# Altium schematic sheet 32电路图.SchDoc
size A3
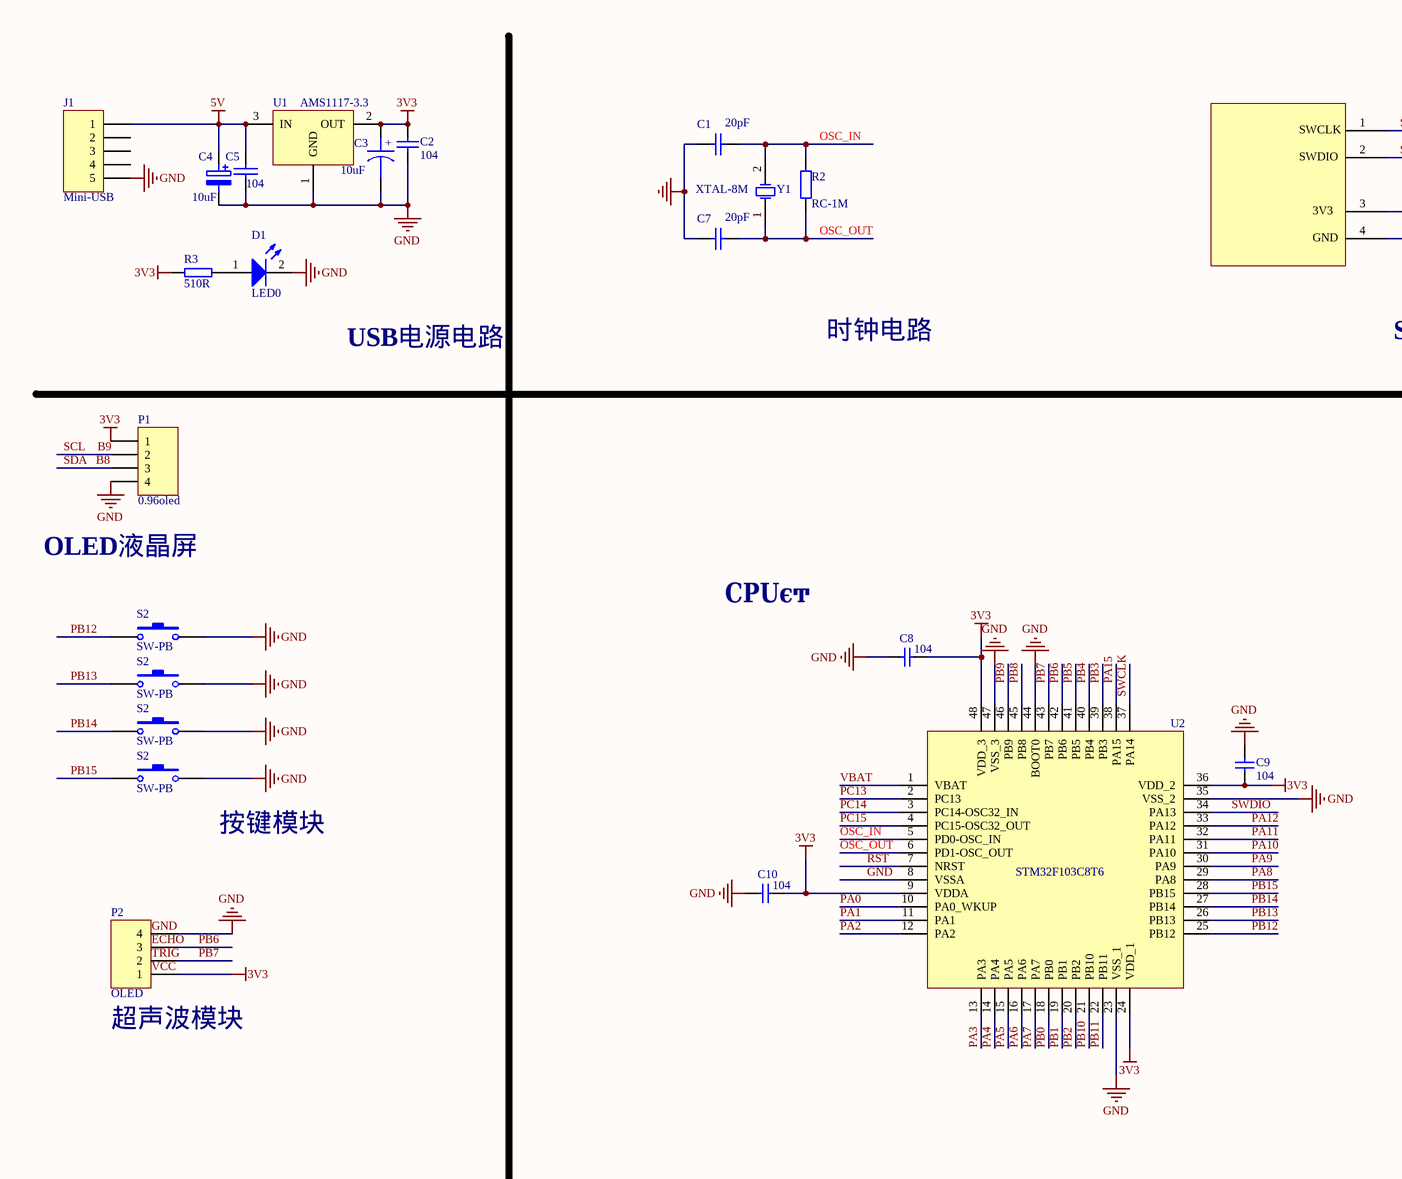
[diagram p0: 32电路图.SchDoc, left]
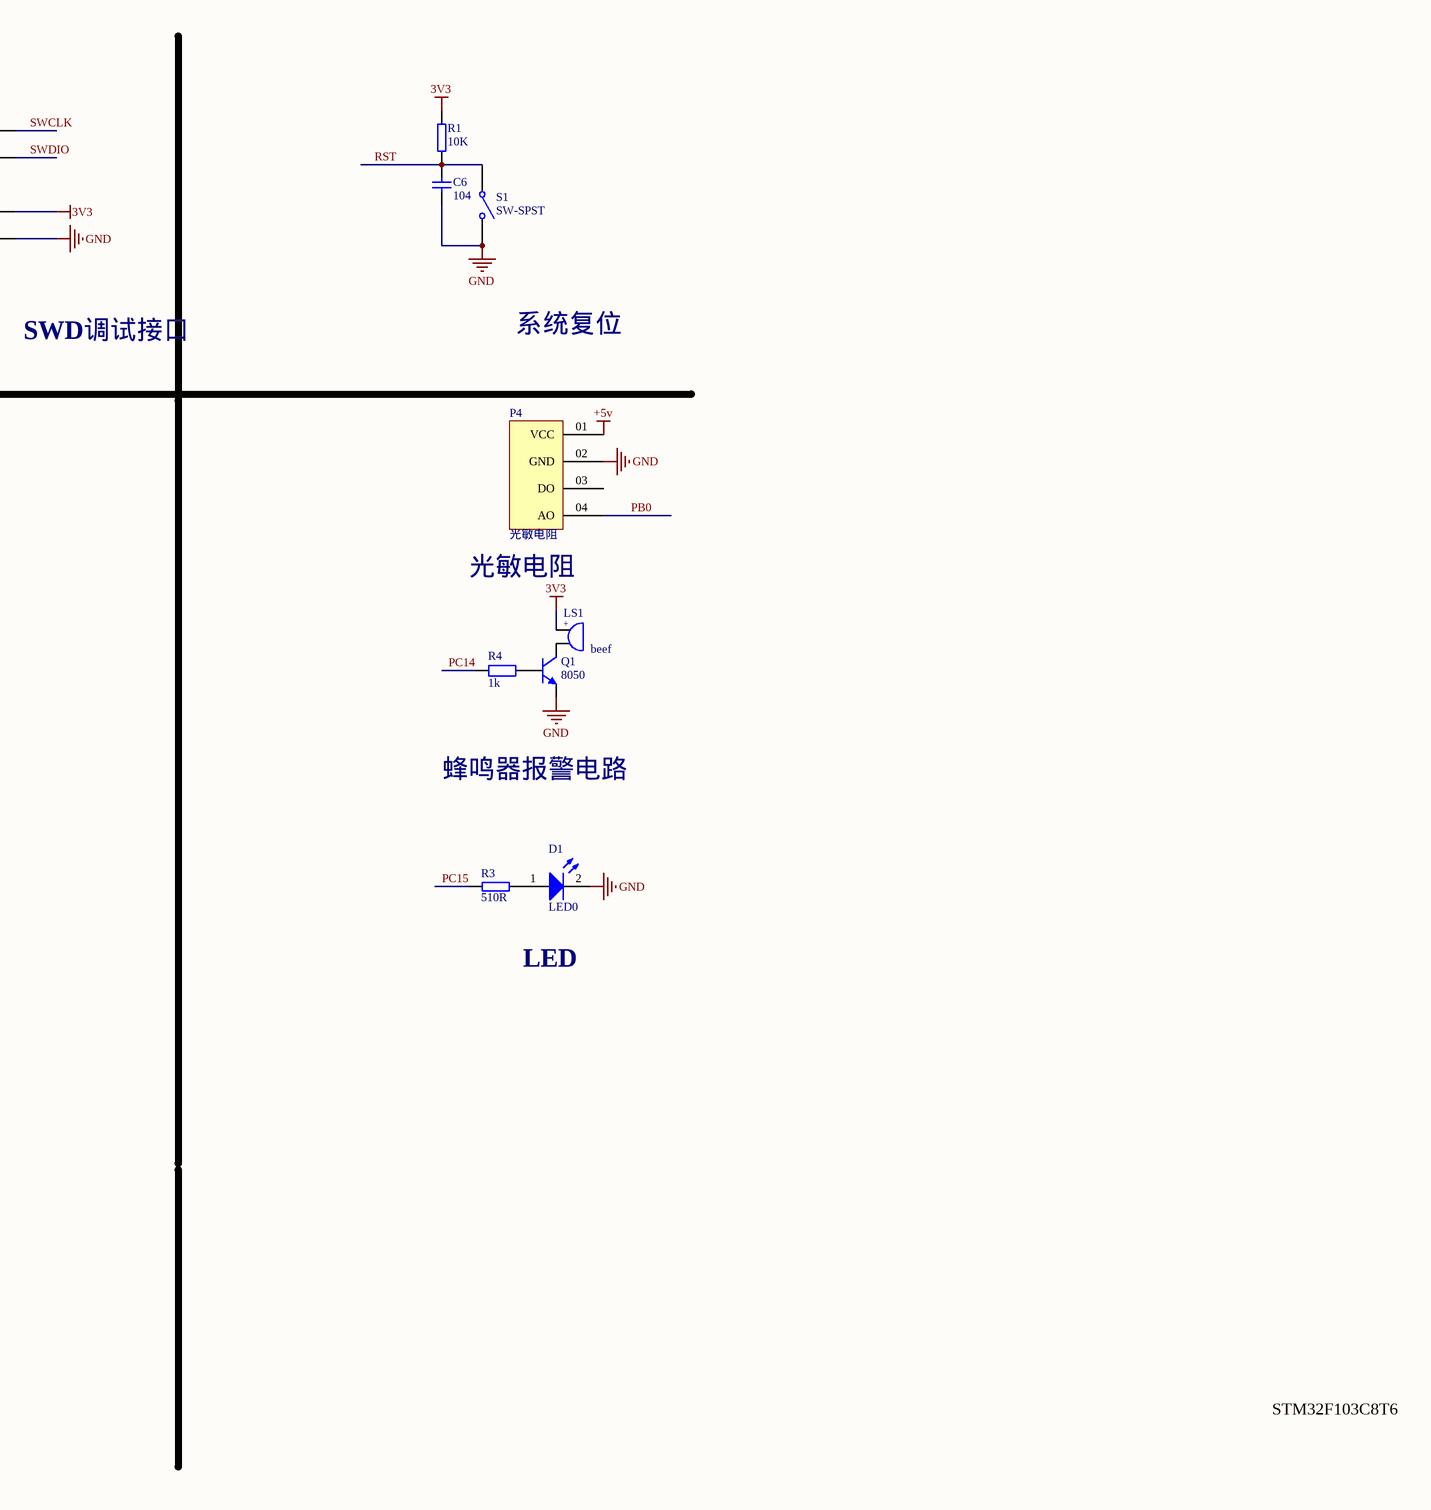
[diagram p1: 32电路图.SchDoc, right]

## Parts
(Parts that share a designator on the sheet are numbered #1, #2 ... from top to bottom, then left to right.)
C1  value 20pF  [0805C]  (hidden comment: S0805-20P)
C2  104  [RC0603]
C3  10uF  [RC0805]
C4  10uF  [RC0805]
C5  104  [RC0603]
C6  104  [RC0603]
C7  value 20pF  [0805C]  (hidden comment: S0805-20P)
C8  104  [RC0603]
C9  104  [RC0603]
C10  104  [RC0603]
D1#1  LED0  [LED0805]
D1#2  LED0  [LED0805]
J1  Mini-USB  [mini_USB]
LS1  beef  [BEEP 5x9x5.5]
P1  0.96oled  [HDR1X4]
P2  OLED  [HDR1X4]
P4  光敏电阻
Q1  8050  [TO92A]
R1  10K  [RC0603]
R2  RC-1M  [0805]
R3#1  510R  [RC0603]
R3#2  510R  [RC0603]
R4  1k  [R 0805_L]
S1  SW-SPST  [SMT-KEY]
S2#1  SW-PB  [SPST-2]
S2#2  SW-PB  [SPST-2]
S2#3  SW-PB  [SPST-2]
S2#4  SW-PB  [SPST-2]
U1  AMS1117-3.3  [SOT223]
U2  STM32F103C8T6  [LQFP48_STM32]
Y1  XTAL-8M  [XTAL-SMD1]

## Nets
3V3: C2.1 C3.1 C8.1 C9.1 C10.1 LS1.1 P1.1 P2.1 R1.2 R3#1.2 U1.2(OUT) U2.9(VDDA) U2.24(VDD_1) U2.36(VDD_2) U2.48(VDD_3)
5V: C4.1 C5.1 J1.1 U1.3(IN)
+5v: P4.01(VCC)
GND: C1.1 C2.2 C3.2 C4.2 C5.2 C6.2 C7.1 C8.2 C9.2 C10.2 D1#1.2(K) D1#2.2(K) J1.5 P1.4 P2.4 P4.02(GND) Q1.1(E) S1.2(NO) S2#1.2 S2#2.2 S2#3.2 S2#4.2 U1.1(GND) U2.8(VSSA) U2.23(VSS_1) U2.35(VSS_2) U2.44(BOOT0) U2.47(VSS_3)
OSC_IN: C1.2 R2.2 U2.5(PD0-OSC_IN) Y1.2(OSC2)
OSC_OUT: C7.2 R2.1 U2.6(PD1-OSC_OUT) Y1.1(OSC1)
PA0: U2.10(PA0_WKUP)
PA1: U2.11(PA1)
PA2: U2.12(PA2)
PA3: U2.13(PA3)
PA4: U2.14(PA4)
PA5: U2.15(PA5)
PA6: U2.16(PA6)
PA7: U2.17(PA7)
PA8: U2.29(PA8)
PA9: U2.30(PA9)
PA10: U2.31(PA10)
PA11: U2.32(PA11)
PA12: U2.33(PA12)
PA15: U2.38(PA15)
PB0: P4.04(AO) U2.18(PB0)
PB1: U2.19(PB1)
PB2: U2.20(PB2)
PB3: U2.39(PB3)
PB4: U2.40(PB4)
PB5: U2.41(PB5)
PB6: P2.3 U2.42(PB6)
PB7: P2.2 U2.43(PB7)
PB8: U2.45(PB8)
PB9: U2.46(PB9)
PB10: U2.21(PB10)
PB11: U2.22(PB11)
PB12: S2#1.1 U2.25(PB12)
PB13: S2#2.1 U2.26(PB13)
PB14: S2#3.1 U2.27(PB14)
PB15: S2#4.1 U2.28(PB15)
PC13: U2.2(PC13)
PC14: R4.1 U2.3(PC14-OSC32_IN)
PC15: R3#2.2 U2.4(PC15-OSC32_OUT)
RST: C6.1 R1.1 S1.1(COMMON) U2.7(NRST)
SCL    B9: P1.2
SDA   B8: P1.3
SWCLK: U2.37(PA14)
SWDIO: U2.34(PA13)
VBAT: U2.1(VBAT)
NetD1#1_1: D1#1.1(A) R3#1.1
NetD1#2_1: D1#2.1(A) R3#2.1
NetLS1_2: LS1.2 Q1.3(C)
NetQ1_2: Q1.2(B) R4.2

Not connected (* = marked no-connect by the designer): J1 2 3 4; P4 03(DO)

## Notes on the sheet
- SWCLK
- SWDIO
- 1
- 2
- 3V3
- GND
- 3
- 4
- USB电源电路
- 时钟电路
- SWD调试接口
- 系统复位
- OLED液晶屏
- 光敏电阻
- CPUϵͳ
- 蜂鸣器报警电路
- (near S2#4) 按键模块
- LED
- (near P2) 超声波模块
- STM32F103C8T6
- Labels drawn without touching a wire or pin: ECHO, GND, TRIG, VCC
- (in symbol BEEP) +
- (in symbol CAPACITOR POL) +

## Library data of the parts
C1 C2 C7 = Cap: Capacitor; Published: 8-Jun-2000; LatestRevisionDate: 17-Jul-2002; LatestRevisionNote: Re-released for DXP Platform.; Publisher: Altium Limited
  C2: PackageReference: RAD-0.3
C3 = CAPACITOR POL: Capacitor
C4 = ELECTRO2
C5 = CAP: Capacitor
C6 = CAP1: Capacitor; Tolerate: 50V; Value: 100nF; TOL: 10%; ERP: 0103020075; PCB_Layout: Top Layer SMC; Revision: 2012-3-28; Publisher: ZL_A0OFFICE
C8-C10 = CAP1: Capacitor; Tolerate: 50V; Value: 20pF; TOL: 2%; ERP: 0103020090; PCB_Layout: Top Layer SMC; Revision: 2012-3-28; Publisher: ZL_A0OFFICE
D1#1 D1#2 = LED0: Typical INFRARED GaAs LED
J1 = Header 5: Header, 5-Pin
LS1 = BEEP: 蜂鸣器; 版权归属: 封装库来自淘宝 ID：黄晶宝石; BOM名称: 蜂鸣器; 联系售后: https://shop463601444.taobao.com
P1 P2 = Header 4: Header, 4-Pin; LatestRevisionDate: 17-Jul-2002; LatestRevisionNote: Re-released for DXP Platform.; Publisher: Altium Limited
P4 = Component_1
Q1 = 8050-DIP: 高频放大-NPN型; 版权归属: 封装库来自淘宝 ID：黄晶宝石; 属性: 40V 1.5A 1W 100MHZ; BOM名称: 高频放大-NPN型; 学习资源: https://shop463601444.taobao.com
R1 R3#1 R3#2 = R
R2 = Res2: Resistor; Published: 8-Jun-2000; LatestRevisionDate: 17-Jul-2002; LatestRevisionNote: Re-released for DXP Platform.; Publisher: Altium Limited; Value: RC-1M
R4 = R: 贴片电阻; 版权归属: 来自淘宝 ID：黄晶宝石; BOM名称: 贴片电阻; 联系售后: https://shop463601444.taobao.com
S1 = SW-SPST: Single-Pole, Single-Throw Switch
S2#1-S2#4 = SW-PB: Switch; Published: 24-Mar-1999; LatestRevisionDate: 17-Jul-2002; LatestRevisionNote: Re-released for DXP Platform.; PackageReference: SPST-2; Publisher: Altium Limited; PackageDescription: Switch; 2 Leads
U1 = LT1085CM-3.3
U2 = STM32_LQFP48
Y1 = XTAL: Crystal Oscillator; Published: *; LatestRevisionDate: *; LatestRevisionNote: *; Publisher: *